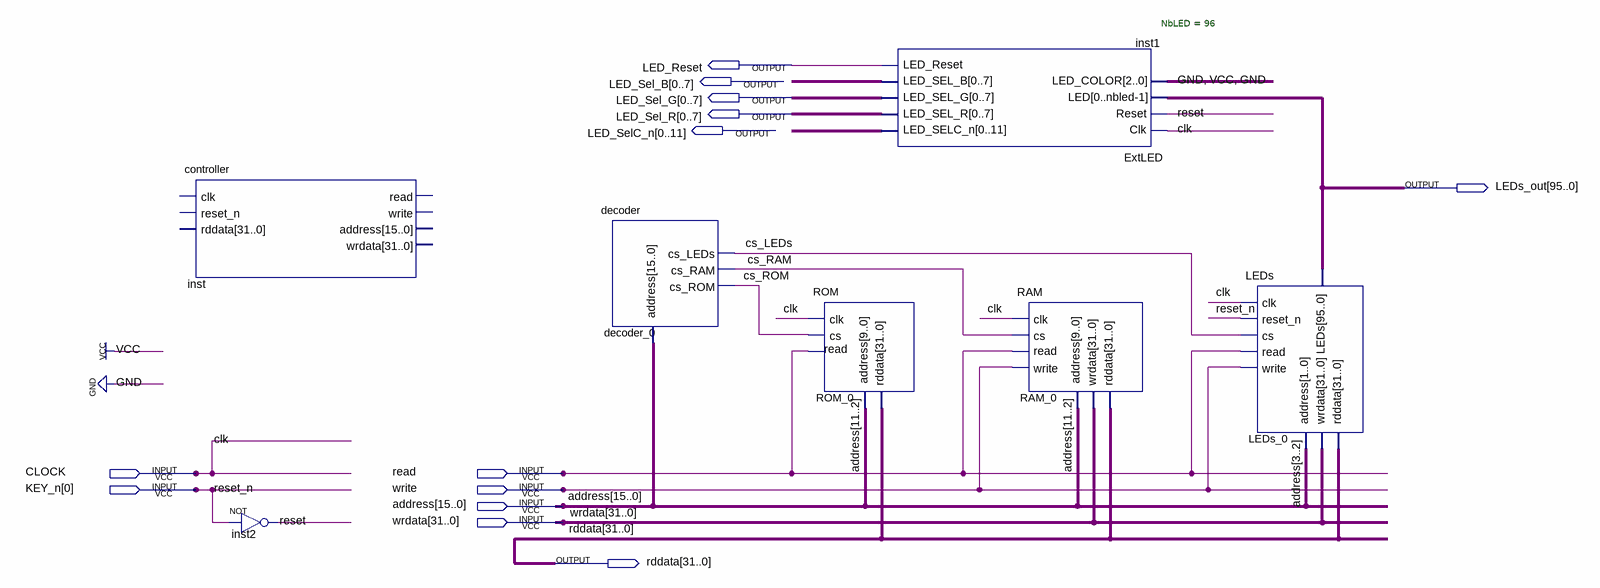
[diagram p0: schematic sheet]
// Quartus schematic memories.bdf as structural Verilog: 7 symbols, 13 pins
module memories (
  input  CLOCK,
  input  read,
  input  [0:0] KEY_n,
  input  write,
  input  [15:0] address,
  input  [31:0] wrdata,
  output LED_Reset,
  output [0:7] LED_Sel_B,
  output [0:7] LED_Sel_G,
  output [0:7] LED_Sel_R,
  output [0:11] LED_SelC_n,
  output [95:0] LEDs_out,
  output [31:0] rddata
);

  wire cs_LEDs, cs_RAM, cs_ROM, reset;
  wire [7:0] inst1_led_sel_b;
  wire [11:0] inst1_led_selc_n;

  controller inst ();  // open: clk, reset_n, rddata, read, write, address, wrdata
  not inst2 (reset, KEY_n[0]);
  decoder decoder_0 (.address(address), .cs_RAM(cs_RAM), .cs_ROM(cs_ROM), .cs_LEDs(cs_LEDs));
  ROM ROM_0 (.clk(CLOCK), .cs(cs_ROM), .read(read), .address(address[11:2]), .rddata(rddata));
  ExtLED #(.NbLED(96)) inst1 (
    .Clk(CLOCK), .Reset(reset), .LED(LEDs_out), .LED_COLOR(3'b010), .LED_SELC_n(inst1_led_selc_n),
    .LED_SEL_R(LED_Sel_R), .LED_SEL_G(LED_Sel_G), .LED_SEL_B(inst1_led_sel_b), .LED_Reset(LED_Reset));
  RAM RAM_0 (
    .clk(CLOCK), .cs(cs_RAM), .write(write), .wrdata(wrdata), .read(read), .address(address[11:2]),
    .rddata(rddata));
  LEDs LEDs_0 (
    .clk(CLOCK), .reset_n(KEY_n[0]), .cs(cs_LEDs), .write(write), .address(address[3:2]), .wrdata(wrdata),
    .read(read), .rddata(rddata), .LEDs(LEDs_out));

  // Other names for the same wires on the sheet: clk = CLOCK; reset_n = KEY_n[0]
endmodule
